# Altium schematic sheet Connections.SchDoc
size A4
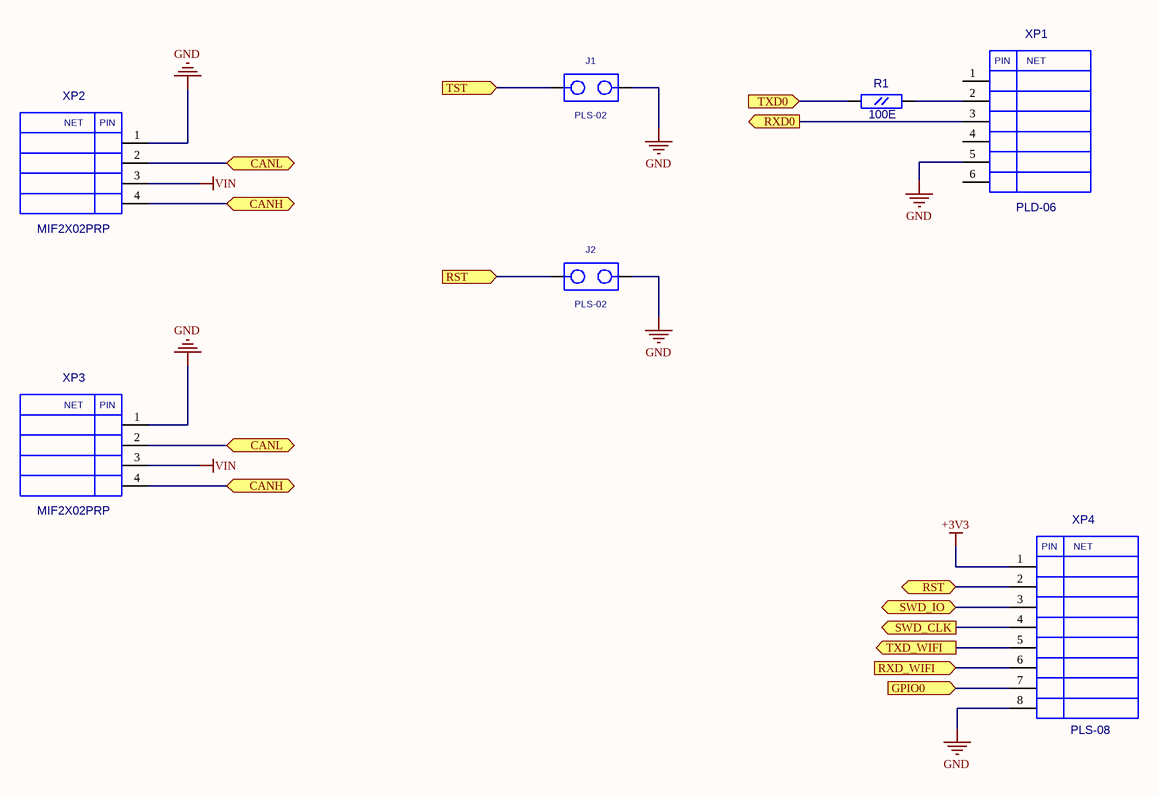
[diagram p0: Connections.SchDoc]

## Parts
J1  PLS-02  [PLS-02]
J2  PLS-02  [PLS-02]
R1  100E  [RC0603]
XP1  PLD-06  [PIN6]
XP2  MIF2X02PRP  [MIF2X02PRP]
XP3  MIF2X02PRP  [MIF2X02PRP]
XP4  PLS-08  [PLS-08]

## Ports
CANH (bidir), CANL (bidir), GPIO0 (in), RST (bidir), RST (in), RXD0 (out), RXD_WIFI (in), SWD_CLK (out), SWD_IO (bidir), TST (in), TXD0 (in), TXD_WIFI (out)

## Nets
+3V3: XP4.1
GND: J1.2 J2.2 XP1.5 XP2.1 XP3.1 XP4.8
VIN: XP2.3 XP3.3
CANH: XP2.4 XP3.4 ; port CANH
CANL: XP2.2 XP3.2 ; port CANL
GPIO0: XP4.7 ; port GPIO0
RST: J2.1 XP4.2 ; port RST
RXD0: XP1.3 ; port RXD0
RXD_WIFI: XP4.6 ; port RXD_WIFI
SWD_CLK: XP4.4 ; port SWD_CLK
SWD_IO: XP4.3 ; port SWD_IO
TST: J1.1 ; port TST
TXD0: R1.1(A) ; port TXD0
TXD_WIFI: XP4.5 ; port TXD_WIFI
NetR1_2: R1.2(B) XP1.2

Not connected (* = marked no-connect by the designer): XP1 1 4 6

## Notes on the sheet
- (in symbol MIF2X02PRP) NET; PIN
- (in symbol PLD-06) PIN; NET
- (in symbol PLS-08) PIN; NET

## Library data of the parts
R1 = RC0603: Value: 100E
XP1 = PLD-06: PLD06; Value: *
J1 J2 = PLS-02: Value: *
XP2 XP3 = MIF2X02PRP: Value: *
XP4 = PLS-08: Value: *